# Altium schematic sheet ct_frontend.SchDoc: USB Interface
size Letter; Organization: NewAE Technology Inc.; Address1: 1083 Queen St., Suite 196; Address2: Halifax; Address3: NS; Address4: Canada B3H 0B2; SheetNumber: 7; SheetTotal: 8; SheetApproved: YES
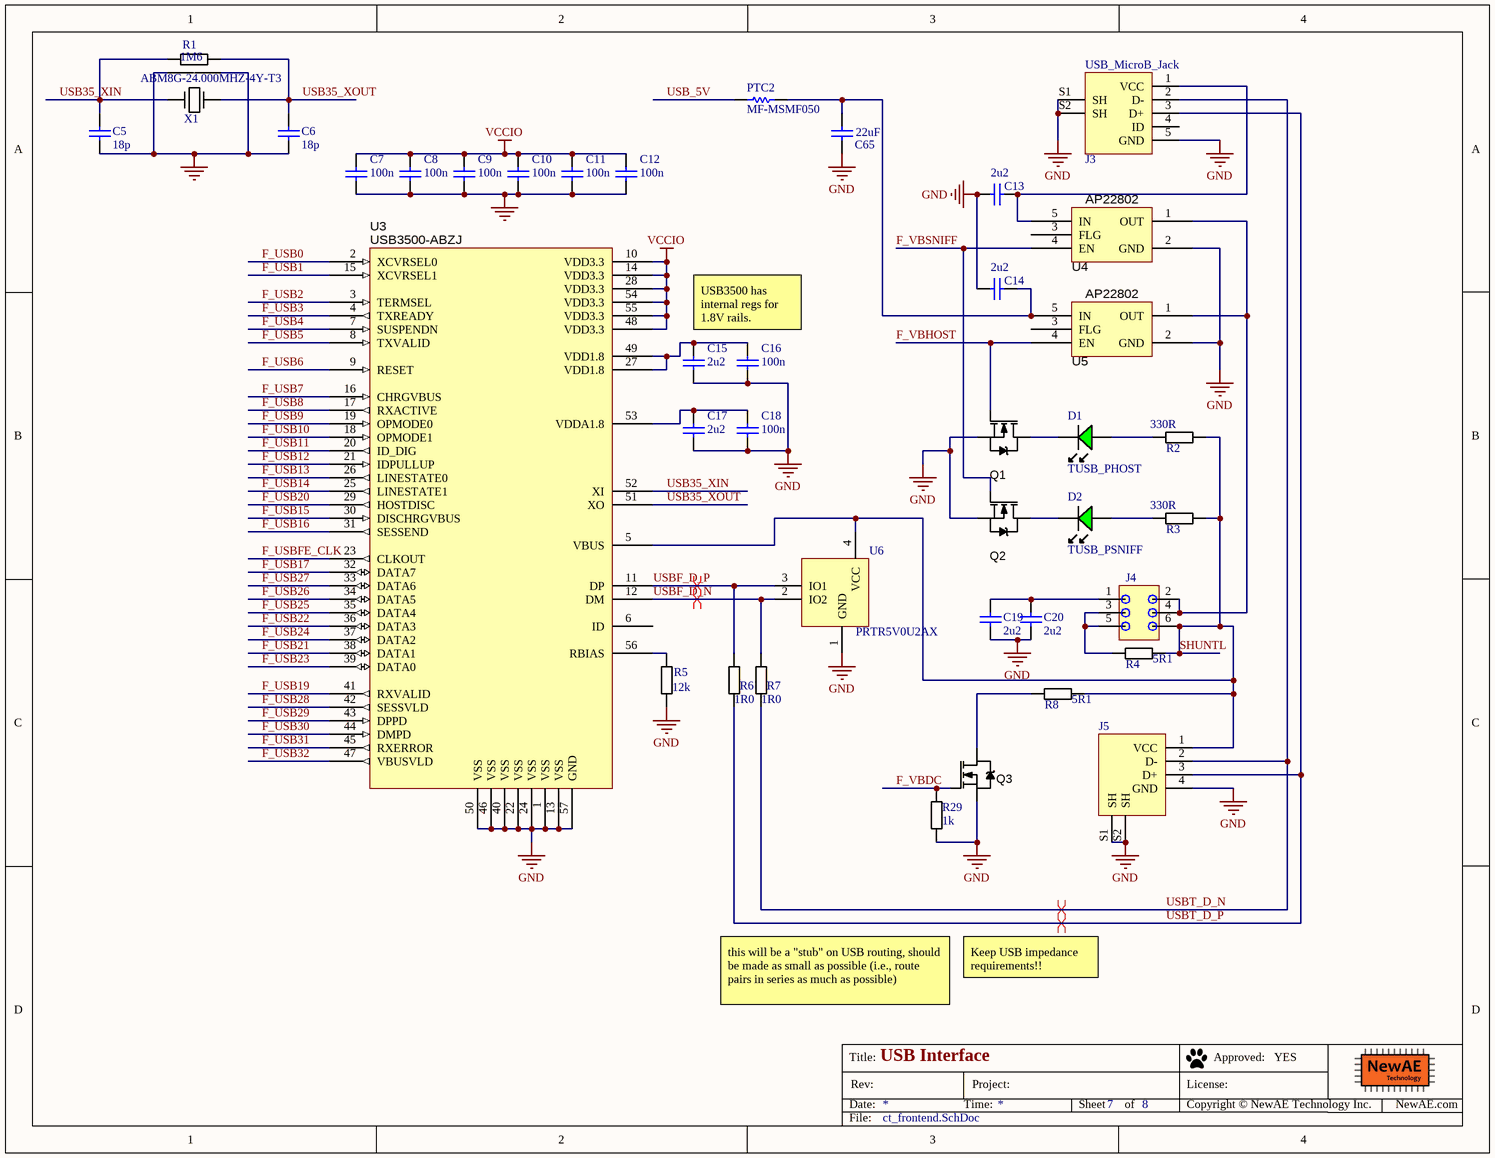
[diagram p0: ct_frontend.SchDoc]

## Parts
C5  18p  [CAPC0402_M]
C6  18p  [CAPC0402_M]
C7  100n  [CAPC0603_M]
C8  100n  [CAPC0603_M]
C9  100n  [CAPC0603_M]
C10  100n  [CAPC0603_M]
C11  100n  [CAPC0603_M]
C12  100n  [CAPC0603_M]
C13  2u2  [CAPC0603_M]
C14  2u2  [CAPC0603_M]
C15  2u2  [CAPC0603_M]
C16  100n  [CAPC0603_M]
C17  2u2  [CAPC0603_M]
C18  100n  [CAPC0603_M]
C19  2u2  [CAPC0603_M]
C20  2u2  [CAPC0603_M]
C65  22uF  [CAPC0805_M]
D1  TUSB_PHOST  [LED-0603-GREEN]
D2  TUSB_PSNIFF  [LED-0603-GREEN]
J3  USB_MicroB_Jack  [ZX62D-B-5P8(30)]
J4  TSW-103-08-F-D-RA  [HDR_6PIN_2ROW_RA_UNSHROUDED]  (value not drawn)
J5  USB-A-S-F-W-TH  [USB-A-S-F-W-TH]  (value not drawn)
PTC2  MF-MSMF050  [BOUR-MF-MSMF050-2_V]
Q1  DMN3200U-7  [SOT95P245X110-3M]  (value not drawn)
Q2  DMN3200U-7  [SOT95P245X110-3M]  (value not drawn)
Q3  DMN3200U-7  [SOT95P245X110-3M]  (value not drawn)
R1  1M6  [RESC1608X55N]
R2  330R  [RESC1608X55N]
R3  330R  [RESC1608X55N]
R4  5R1  [RESC2012X70N]
R5  12k  [RESC1608X55N]
R6  1R0  [RESC1608X55N]
R7  1R0  [RESC1608X55N]
R8  5R1  [RESC2012X70N]
R29  1k  [RESC1608X55N]
U3  USB3500-ABZJ  [QFN50P800X800X100_HS-57M]
U4  AP22802  [SOT23-5P95_285X145L45X40]
U5  AP22802  [SOT23-5P95_285X145L45X40]
U6  PRTR5V0U2AX  [SOT143B]
X1  ABM8G-24.000MHZ-4Y-T3  [ABM8G]

## Nets
GND: C5.2 C6.2 C7.2 C8.2 C9.2 C10.2 C11.2 C12.2 C13.1 C14.1 C15.2 C16.2 C17.2 C18.2 C19.1 C20.1 C65.2 J3.5(GND) J3.S1(SH) J3.S2(SH) J5.4(GND) J5.S1(SH) J5.S2(SH) Q1.2(S) Q2.2(S) Q3.2(S) R5.2 R29.1 U3.1(VSS) U3.13(VSS) U3.22(VSS) U3.24(VSS) U3.40(VSS) U3.46(VSS) U3.50(VSS) U3.57(GND) U4.2(GND) U5.2(GND) U6.1(GND) X1.2(GND) X1.4(GND)
VCCIO: C7.1 C8.1 C9.1 C10.1 C11.1 C12.1 U3.10(VDD3.3) U3.14(VDD3.3) U3.28(VDD3.3) U3.48(VDD3.3) U3.54(VDD3.3) U3.55(VDD3.3)
F_USB0: U3.2(XCVRSEL0)
F_USB1: U3.15(XCVRSEL1)
F_USB2: U3.3(TERMSEL)
F_USB3: U3.4(TXREADY)
F_USB4: U3.7(SUSPENDN)
F_USB5: U3.8(TXVALID)
F_USB6: U3.9(RESET)
F_USB7: U3.16(CHRGVBUS)
F_USB8: U3.17(RXACTIVE)
F_USB9: U3.19(OPMODE0)
F_USB10: U3.18(OPMODE1)
F_USB11: U3.20(ID_DIG)
F_USB12: U3.21(IDPULLUP)
F_USB13: U3.26(LINESTATE0)
F_USB14: U3.25(LINESTATE1)
F_USB15: U3.30(DISCHRGVBUS)
F_USB16: U3.31(SESSEND)
F_USB17: U3.32(DATA7)
F_USB19: U3.41(RXVALID)
F_USB20: U3.29(HOSTDISC)
F_USB21: U3.38(DATA1)
F_USB22: U3.36(DATA3)
F_USB23: U3.39(DATA0)
F_USB24: U3.37(DATA2)
F_USB25: U3.35(DATA4)
F_USB26: U3.34(DATA5)
F_USB27: U3.33(DATA6)
F_USB28: U3.42(SESSVLD)
F_USB29: U3.43(DPPD)
F_USB30: U3.44(DMPD)
F_USB31: U3.45(RXERROR)
F_USB32: U3.47(VBUSVLD)
F_USBFE_CLK: U3.23(CLKOUT)
F_VBDC: Q3.1(G) R29.2
F_VBHOST: Q1.1(G) U5.4(EN)
F_VBSNIFF: Q2.1(G) U4.4(EN)
SHUNTL: J4.6 J5.1(VCC) R2.2 R3.2 R4.2 R8.2 U3.5(VBUS) U6.4(VCC)
USB35_XIN: C5.1 R1.1 U3.52(XI) X1.1(IN)
USB35_XOUT: C6.1 R1.2 U3.51(XO) X1.3(OUT)
USB_5V: PTC2.1
USBF_D_N: R7.1 U3.12(DM) U6.2(IO2)
USBF_D_P: R6.1 U3.11(DP) U6.3(IO1)
USBT_D_N: J3.2(D-) J5.2(D-) R7.2
USBT_D_P: J3.3(D+) J5.3(D+) R6.2
NetC13_2: C13.2 J3.1(VCC) U4.5(IN)
NetC14_2: C14.2 C65.1 PTC2.2 U5.5(IN)
NetC15_1: C15.1 C16.1 U3.27(VDD1.8) U3.49(VDD1.8)
NetC17_1: C17.1 C18.1 U3.53(VDDA1.8)
NetC19_2: C19.2 C20.2 J4.1
NetD1_A: D1.A R2.1
NetD1_K: D1.K Q1.3(D)
NetD2_A: D2.A R3.1
NetD2_K: D2.K Q2.3(D)
NetJ4_2: J4.2 J4.4 U4.1(OUT) U5.1(OUT)
NetJ4_3: J4.3 J4.5 R4.1
NetQ3_3: Q3.3(D) R8.1
NetR5_1: R5.1 U3.56(RBIAS)

Not connected (* = marked no-connect by the designer): J3 4(ID); U3 6(ID); U4 3(FLG); U5 3(FLG)

## Layout directives
differential pair: USBF_D_N, USBF_D_P, USBT_D_N, USBT_D_P

## Notes on the sheet
- USB3500 has internal regs for 1.8V rails.
- Keep USB impedance requirements!!
- this will be a "stub" on USB routing, should be made as small as possible (i.e., route pairs in series as much as possible)
- Title:
- Date:
- Rev:
- Time:
- Project:
- Sheet
- of
- License:
- Copyright © NewAE Technology Inc.
- Approved:
- NewAE.com
- File:

## Library data of the parts
C5 C6 = CCHIP-18p-0402: 18p, 0402; Manufacture Part Number 1: GRM1555C1H180JA01D; Component Group: Capacitor; Case-EIA: 0402; Part Number: CCHIP-18p-0402; Footprint: 0402; Pin Count: 2; Value: 18p; Mounting Technology: SMT; Component Kind: Standard; Component Type: Standard
C7-C12 C16 C18 = CCHIP-100n-0603: 100n, 0603; Manufacture 1: Kemet; Manufacture Part Number 1: C0603C104K5RACTU; Component Group: Capacitor; Case-EIA: 0603; Case-Metric: 1608; Rated Voltage: 50VDC; Part Number: CCHIP-100n-0603; Footprint: 0603; Pin Count: 2; Supplier 1: Digi-Key; Supplier Part Number 1: 399-5089-2-ND; Value: 100n; Mounting Technology: SMT; Component Kind: Standard; Component Type: Standard
C13-C15 C17 C19 C20 = CCHIP-2u2-0603: 2u2, 0603; Manufacture 1: Samsung; Manufacture Part Number 1: CL10B225KP8NNNC; Component Group: Capacitor; Case-EIA: 0603; Case-Metric: 1608; Rated Voltage: 10VDC; Part Number: CCHIP-2u2-0603; Footprint: 0603; Pin Count: 2; Supplier 1: Digi-Key; Supplier Part Number 1: 1276-1134-2-ND; Value: 2u2; Mounting Technology: SMT; Component Kind: Standard; Component Type: Standard
C65 = CCHIP-22u-0805-16V: 22u, 16V, 0805, Ceramic; Manufacture 1: Samsung Electro-Mechanics; Manufacture Part Number 1: CL21A226MOCLRNC; Component Group: Capacitor; Case-EIA: 0805; Case-Metric: 1608; Rated Voltage: 16VDC; Tolerance: 20%; Part Number: CCHIP-22u-0805-16V; Footprint: 0805; Pin Count: 2; Supplier 1: Digi-Key; Supplier Part Number 1: 1276-6780-1-ND; Value: 22uF; Mounting Technology: SMT; RoHS: Yes; Component Kind: Standard; Component Type: Standard
D1 D2 = LEDCHIP_0603_GREEN: Chip LED, Green; Manufacture 1: Kingbright; Manufacture Part Number 1: APT1608CGCK; Component Group: Optical; PP Material Stack: 16; PP Rotation: -90; Part Number: LEDCHIP_0603_GREEN; Pin Count: 2; Supplier 1: Digi-Key; Supplier Part Number 1: 754-1116-1-ND; Mounting Technology: SMT; Component Kind: Standard; Component Type: Standard
J3 = ZX62D-B-5P8(30): CONN RCPT USB MICRO B SMD; Manufacture 1: Hirose Electric Co Ltd; Component Group: Connector; PP Material Stack: 0; Part Number: ZX62D-B-5P8(30); Manufacture Part Number 1: ZX62D-B-5P8(30); Pin Count: 5; Supplier 1: Digi-Key; Supplier Part Number 1: H125272CT-ND; Mounting Technology: Through-hole; RoHS: Yes; Component Kind: Standard; Component Type: Standard; PP Rotation: 0
J4 = HDR_6PIN_2ROW_RA_UNSHROUDED: 2x3 Header, R/A, Unshrouded; Manufacture 1: Samtec; Component Group: Connector; PP Material Stack: 0; Part Number: HDR_6PIN_2ROW_RA_UNSHROUDED; Footprint: HDR_6PIN_2ROW_UNSHROUDED; Manufacture Part Number 1: TSW-103-08-F-D-RA; Pin Count: 6; Component Kind: Standard; Component Type: Standard; PP Rotation: 0
J5 = USB-A-S-F-W-TH: Female USB-A; Manufacture 1: Samtec; Component Group: Connector; PP Material Stack: 0; Part Number: USB-A-S-F-W-TH; Manufacture Part Number 1: USB-A-S-F-W-TH; Pin Count: 6; Component Kind: Standard; Component Type: Standard; PP Rotation: 0
PTC2 = CMP-0280-00002-2: MF-MSMF Series - PTC Resettable Fuse, 15 V Max, 0.15 Ohm Min, -40 to 85 degC, RoHS, Reel; Manufacturer: Bourns; Voltage DC (Max): 15 V; Trip Current: 1 A; Hold Current: 0.5 A; Current Rating (Max): 100 A; ComponentLink1Description: Manufacturer URL; Operating Temperature Range: -40 to 85 degC; ComponentLink2URL: http://www.bourns.com/data/global/pdfs/mfmsmf.pdf; PackageReference: MF-MSMF050; ComponentLink2Description: Datasheet; PartNumber: MF-MSMF050; DatasheetVersion: Rev. AD; ComponentLink3URL: http://www.bourns.com/data/global/pdfs/mfmsmf.pdf; ComponentLink3Description: Package Specification; RoHS: TRUE; PackageDescription: 2-Pin SMD, Body 4.55 x 3.24 mm; Mounting Technology: Surface Mount; Packing: Reel; Resistance (Min): 0.15 Ohm; ComponentLink1URL: http://www.bourns.com/; Supplier 1: Digi-Key; Supplier Part Number 1: MF-MSMF050-2CT-ND
Q1-Q3 = DMN3200U-7: MOSFET N-CH 30V 2.2A SOT23-3; Manufacture 1: Diodes Inc.; Rated Power: 3A; PP Material Stack: 0; Part Number: DMN3200U-7; Component Group: MOSFET; Footprint: SOT23; Manufacture Part Number 1: DMN3200U-7; Pin Count: 3; Supplier 1: Digi-Key; Supplier Part Number 1: DMN3200U-7DICT-ND; Rated Voltage: 30V; Mounting Technology: SMT; RoHS: Yes; Component Kind: Standard; Component Type: Standard; PP Rotation: 0
R1 = RCHIP-1M6-0603: 1M6 res, 0603, 1%, 1/10W; Manufacture 1: Yageo; Manufacture Part Number 1: RC0603FR-071M6L; Component Group: Resistor; Case-EIA: 0603; Case-Metric: 1608; Rated Power: 0.1W; Rated Voltage: 75VDC; Part Number: RCHIP-1M6-0603; Footprint: 0603; Pin Count: 2; Supplier 1: Digi-Key; Supplier Part Number 1: YAG3327CT-ND; Value: 1M6; Tolerance: 1%; Mounting Technology: SMT; RoHS: Yes; Temperature Range: -55C to 155C; Component Kind: Standard; Component Type: Standard
R2 R3 = RCHIP-330R-0603: 330R res, 0603, 1%, 1/10W; Manufacture 1: Yageo; Manufacture Part Number 1: RC0603FR-07330RL; Component Group: Resistor; Case-EIA: 0603; Case-Metric: 1608; Rated Power: 0.1W; Rated Voltage: 75VDC; Part Number: RCHIP-330R-0603; Footprint: 0603; Pin Count: 2; Supplier 1: Digi-Key; Supplier Part Number 1: 311-330HRCT-ND; Value: 330R; Tolerance: 1%; Mounting Technology: SMT; Temperature Range: -55C to 155C; Component Kind: Standard; Component Type: Standard
R4 R8 = RCHIP-5R1-0805: 5R1  res, 0805, 1%; Component Group: Resistor; Case-EIA: 0805; Part Number: RCHIP-5R1-0805; Footprint: 0805; Pin Count: 2; Value: 5R1; Component Kind: Standard; Component Type: Standard; Supplier 1: Digi-Key; Supplier Part Number 1: YAG3373CT-ND
R5 = RCHIP-12K-0603: 12k res, 0603, 1%, 1/10W; Manufacture 1: Yageo; Manufacture Part Number 1: RC0603FR-0712KL; Component Group: Resistor; Case-EIA: 0603; Case-Metric: 1608; Rated Power: 0.1W; Rated Voltage: 75VDC; Part Number: RCHIP-12K-0603; Footprint: 0603; Pin Count: 2; Supplier 1: Digi-Key; Supplier Part Number 1: 311-12.0KHRCT-ND; Value: 12k; Tolerance: 1%; Mounting Technology: SMT; Temperature Range: -55C to 155C; Component Kind: Standard; Component Type: Standard
R6 R7 = RCHIP-1R0-0603: 1R0 res, 0603, 1%, 1/10W; Manufacture 1: Yageo; Manufacture Part Number 1: RC0603FR-071RL; Component Group: Resistor; Case-EIA: 0603; Case-Metric: 1608; Rated Power: 0.1W; Rated Voltage: 75VDC; Part Number: RCHIP-1R0-0603; Footprint: 0603; Pin Count: 2; Supplier 1: Digi-Key; Supplier Part Number 1: 311-1.00HRCT-ND; Value: 1R0; Tolerance: 1%; Mounting Technology: SMT; Temperature Range: -55C to 155C; Component Kind: Standard; Component Type: Standard
R29 = RCHIP-1K-0603: 1k res, 0603, 1%, 1/10W; Manufacture 1: Yageo; Manufacture Part Number 1: RC0603FR-071KL; Component Group: Resistor; Case-EIA: 0603; Case-Metric: 1608; Rated Power: 0.1W; Rated Voltage: 75VDC; Part Number: RCHIP-1K-0603; Footprint: 0603; Pin Count: 2; Supplier 1: Digi-Key; Supplier Part Number 1: 311-1.00KHRCT-ND; Value: 1k; Tolerance: 1%; Mounting Technology: SMT; Temperature Range: -55C to 155C; Component Kind: Standard; Component Type: Standard
U3 = USB3500: USB Phy, UTMI 3+; Manufacture 1: Texas Instruments; Company_PN: <Enter Company P/N>; Component Group: Digital IC; Pitch: 0.5mm; PP Material Stack: 0; Created By: D.GODDARD; Part Number: USB3500; Footprint: QFN56; Manufacture Part Number 1: USB3500-ABZJ; Pin Count: 57; Supplier 1: Digi-Key; Supplier Part Number 1: 638-1035-ND; Mounting Technology: SMT; RoHS: Yes; Component Kind: Standard; Component Type: Standard; PP Rotation: 0
U4 U5 = AP22802: USB Power Switch, Digital IC; Manufacture 1: Diodes Inc; Company_PN: <Enter Company P/N>; Component Group: Analog IC; PP Material Stack: 0; Created By: D.GODDARD; Part Number: AP22802; Footprint: SOT25; Manufacture Part Number 1: AP22802; Pin Count: 5; Supplier 1: Digi-Key; Supplier Part Number 1: AP22802AW5-7DICT-ND; Component Kind: Standard; Component Type: Standard; PP Rotation: 0
U6 = PRTR5V0U2AX: USB 2.0 high-speed ESD; Component Group: Diode; Part Number: PRTR5V0U2AX; Pin Count: 4; Supplier 1: Digi-Key; Supplier Part Number 1: 568-7445-1-ND; Component Kind: Standard; Component Type: Standard
X1 = ABM8G-24.000MHZ-4Y-T3: CRYSTAL 24.0000MHZ 10PF SMD; Manufacture 1: Abracon LLC; Part Number: ABM8G-24.000MHZ-4Y-T3; Component Group: Crystal; Manufacture Part Number 1: ABM8G-24.000MHZ-4Y-T3; Pin Count: 4; Supplier 1: Digi-Key; Supplier Part Number 1: 535-10913-1-ND; Component Kind: Standard; Component Type: Standard; Value: 24.000MHz